# Altium schematic sheet ATmega_MCU.SchDoc
size B; Organization: Mechanart, LLC; Address1: 397 Laurie Meadows Drive; Address2: Apt. 437; Address3: San Mateo, CA 94403
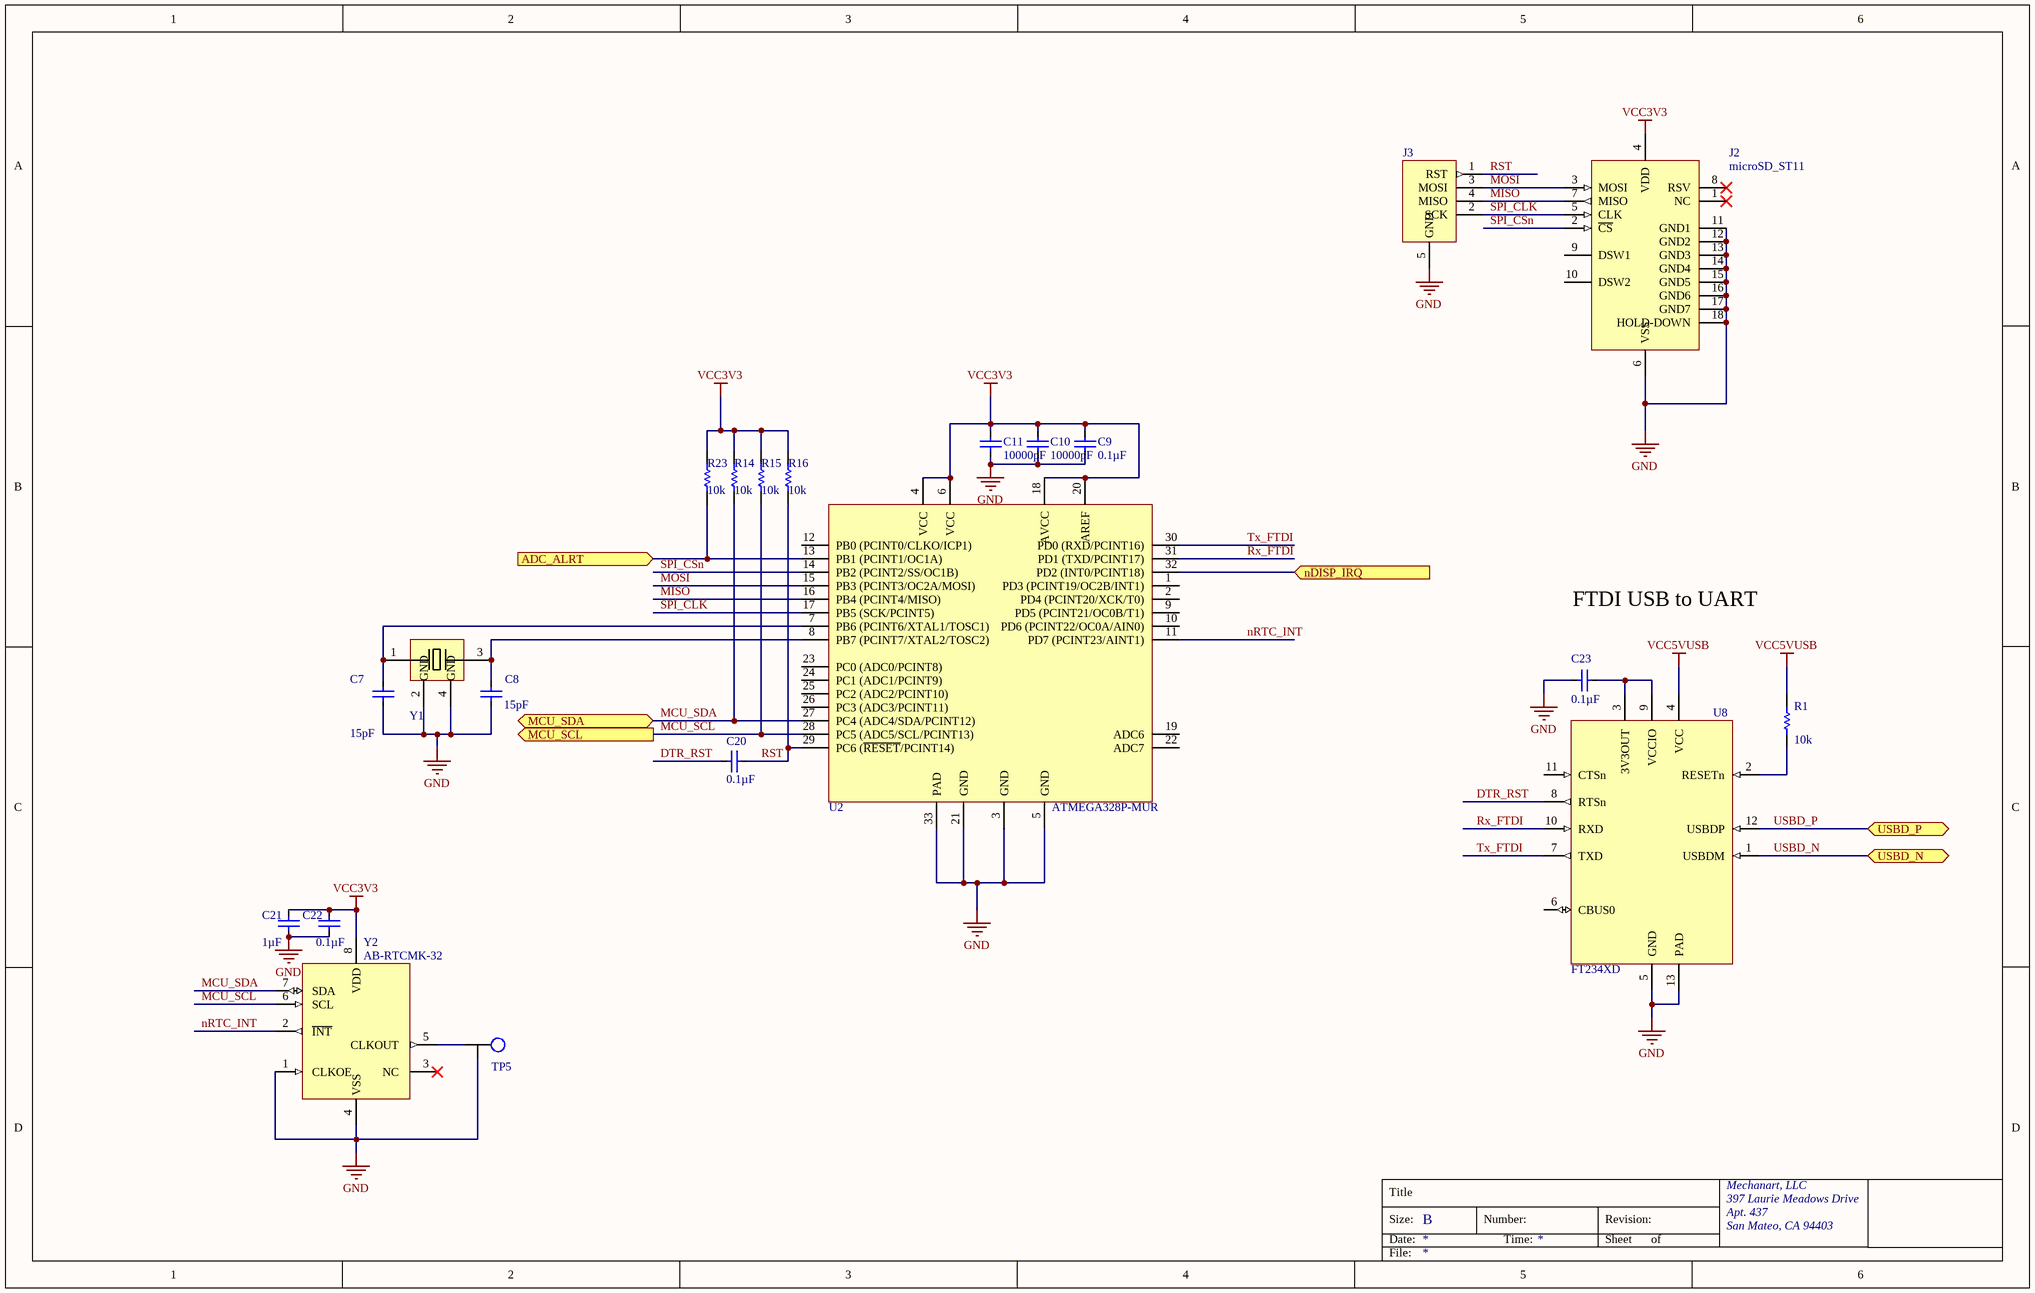
[diagram p0: ATmega_MCU.SchDoc]

## Parts
C7  15pF  [CAPC0603X33L15L]
C8  15pF  [CAPC0603X33L15L]
C9  0.1µF  [CAPC1005X50L25N]
C10  10000pF  [CAPC1005X50L25N]
C11  10000pF  [CAPC1005X50L25N]
C20  0.1µF  [CAPC1005X50L25N]
C21  1µF  [CAPC1005X50L25N]
C22  0.1µF  [CAPC1005X50L25N]
C23  0.1µF  [CAPC1005X50L25N]
J2  microSD_ST11  [microSD_ST11-H]
J3  POGO_SPI  [POGO_SPI]  (value not drawn)
R1  10k  [RESC1608X45L30N]
R14  10k  [RESC1005X40L25N]
R15  10k  [RESC1005X40L25N]
R16  10k  [RESC1005X40L25N]
R23  10k  [RESC1005X40L25N]
TP5  TPwGND  [TPwGND]  (value not drawn)
U2  Manufacturer Part Number: ATMEGA328P-MUR  [QFN50P500X500X100-33T325X325L]  (hidden comment: ATMEGA328P_32MLF)
U8  FT234XD  [SON13P45_300X300X80L40X23T250X160N]
Y1  ABM11  [XTALDFN200X160X59-4L]  (value not drawn)
Y2  AB-RTCMK-32  [SON100P320X250X100-8L]

## Ports
ADC_ALRT (in), MCU_SCL (out), MCU_SDA (bidir), nDISP_IRQ (in), USBD_N (bidir), USBD_P (bidir)

## Nets
GND: C7.2 C8.2 C9.2 C10.2 C11.2 C21.2 C22.2 C23.1 J2.6(VSS) J2.11(GND1) J2.12(GND2) J2.13(GND3) J2.14(GND4) J2.15(GND5) J2.16(GND6) J2.17(GND7) J2.18(HOLD-DOWN) J3.5(GND) TP5.2(GND) U2.3(GND) U2.5(GND) U2.21(GND) U2.33(PAD) U8.5(GND) U8.13(PAD) Y1.2(GND) Y1.4(GND) Y2.1(CLKOE) Y2.4(VSS)
VCC3V3: C9.1 C10.1 C11.1 C21.1 C22.1 J2.4(VDD) R14.2 R15.2 R16.2 R23.2 U2.4(VCC) U2.6(VCC) U2.18(AVCC) U2.20(AREF) Y2.8(VDD)
VCC5VUSB: R1.2 U8.4(VCC)
ADC_ALRT: R23.1 U2.13(PB1_(PCINT1/OC1A)) ; port ADC_ALRT
DTR_RST: C20.1 U8.8(RTSn)
MCU_SCL: R15.1 U2.28(PC5_(ADC5/SCL/PCINT13)) Y2.6(SCL) ; port MCU_SCL
MCU_SDA: R14.1 U2.27(PC4_(ADC4/SDA/PCINT12)) Y2.7(SDA) ; port MCU_SDA
MISO: J2.7(MISO) J3.4(MISO) U2.16(PB4_(PCINT4/MISO))
MOSI: J2.3(MOSI) J3.3(MOSI) U2.15(PB3_(PCINT3/OC2A/MOSI))
nDISP_IRQ: U2.32(PD2_(INT0/PCINT18)) ; port nDISP_IRQ
nRTC_INT: U2.11(PD7_(PCINT23/AINT1)) Y2.2(~{INT})
RST: C20.2 J3.1(RST) R16.1 U2.29(PC6_(~{RESET}/PCINT14))
Rx_FTDI: U2.31(PD1_(TXD/PCINT17)) U8.10(RXD)
SPI_CLK: J2.5(CLK) J3.2(SCK) U2.17(PB5_(SCK/PCINT5))
SPI_CSn: J2.2(~{CS}) U2.14(PB2_(PCINT2/SS/OC1B))
Tx_FTDI: U2.30(PD0_(RXD/PCINT16)) U8.7(TXD)
USBD_N: U8.1(USBDM) ; port USBD_N
USBD_P: U8.12(USBDP) ; port USBD_P
NetC7_1: C7.1 U2.7(PB6_(PCINT6/XTAL1/TOSC1)) Y1.1(OSC1)
NetC8_1: C8.1 U2.8(PB7_(PCINT7/XTAL2/TOSC2)) Y1.3(OSC2)
NetC23_2: C23.2 U8.3(3V3OUT) U8.9(VCCIO)
NetR1_1: R1.1 U8.2(RESETn)
NetTP5_1: TP5.1(TP) Y2.5(CLKOUT)

Not connected (* = marked no-connect by the designer): J2 1(NC)* 8(RSV)* 9(DSW1) 10(DSW2); U2 1(PD3_(PCINT19/OC2B/INT1)) 2(PD4_(PCINT20/XCK/T0)) 9(PD5_(PCINT21/OC0B/T1)) 10(PD6_(PCINT22/OC0A/AIN0)) 12(PB0_(PCINT0/CLKO/ICP1)) 19(ADC6) 22(ADC7) 23(PC0_(ADC0/PCINT8)) 24(PC1_(ADC1/PCINT9)) 25(PC2_(ADC2/PCINT10)) 26(PC3_(ADC3/PCINT11)); U8 6(CBUS0) 11(CTSn); Y2 3(NC)*

## Notes on the sheet
- FTDI USB to UART
- Title
- Size:
- Date:
- B
- Number:
- Time:
- Revision:
- Sheet
- of
- File:

## Library data of the parts
C7 C8 = GJM0335C1E150GB01D: CAP CER 15PF 25V NP0 0201; Manufacturer: Murata Electronics North America; Tolerance: ±2%; Temperature Coefficient: C0G, NP0; Design Item Id: GJM0335C1E150GB01D; Supplier 1: Digi-Key; Supplier Part Number 1: 490-10562-1-ND; Manufacturer Part Number: GJM0335C1E150GB01D; RoHS: RoHS Compliant; Category: Capacitors; Stock 1: 25849; Pricing 1: 1=0.19, 10=0.128, 50=0.0736, 100=0.0608, 250=0.0512, 500=0.04288, 1000=0.0352, 5000=0.02976 (USD); Packaging: Cut Tape (CT); Applications: RF, Microwave, High Frequency; Operating Temperature: -55°C ~ 125°C; Mounting Type: Surface Mount, MLCC; Package / Case: 0201 (0603 Metric); ComponentLink1URL: http://www.murata.com/~/media/webrenewal/support/library/catalog/products/capacitor/mlcc/c02e.ashx; ComponentLink1Description: http://www.murata.com/~/media/webrenewal/support/library/catalog/products/capacitor/mlcc/c02e.ashx; Capacitance: 15pF; Voltage - Rated: 25V; Ratings: -; Size / Dimension: 0.024" L x 0.012" W (0.60mm x 0.30mm); Height - Seated (Max): -; Thickness (Max): 0.013" (0.33mm); Lead Spacing: -; Features: High Q, Low Loss; Lead Style: -
C9 C20 C22 C23 = GRM155R71H104KE14D: CAP CER 0.1UF 50V X7R 0402; Manufacturer: Murata Electronics North America; Tolerance: ±10%; Design Item Id: GRM155R71H104KE14D; Supplier 1: Digi-Key; Supplier Part Number 1: 490-10700-1-ND; Manufacturer Part Number: GRM155R71H104KE14D; RoHS: RoHS Compliant; Category: Capacitors; Stock 1: 28600; Pricing 1: 1=0.1, 10=0.029, 50=0.0156, 100=0.0132, 250=0.0108, 500=0.00924, 1000=0.0072, 5000=0.006 (USD); Packaging: Cut Tape (CT); Applications: General Purpose; Operating Temperature: -55°C ~ 125°C; Mounting Type: Surface Mount, MLCC; Package / Case: 0402 (1005 Metric); ComponentLink1URL: http://www.murata.com/~/media/webrenewal/support/library/catalog/products/capacitor/mlcc/c02e.ashx; ComponentLink1Description: http://www.murata.com/~/media/webrenewal/support/library/catalog/products/capacitor/mlcc/c02e.ashx; Capacitance: 0.1µF; Voltage - Rated: 50V; Temperature Coefficient: X7R; Ratings: -; Size / Dimension: 0.039" L x 0.020" W (1.00mm x 0.50mm); Height - Seated (Max): -; Thickness (Max): 0.022" (0.55mm); Lead Spacing: -; Features: -; Lead Style: -
C10 C11 = GRM155R71H103KA88D: CAP CER 10000PF 50V X7R 0402; Manufacturer: Murata Electronics North America; Tolerance: ±10%; Design Item Id: GRM155R71H103KA88D; Supplier 1: Digi-Key; Supplier Part Number 1: 490-4516-1-ND; Manufacturer Part Number: GRM155R71H103KA88D; RoHS: RoHS Compliant; Category: Capacitors; Stock 1: 2228905; Pricing 1: 1=0.1, 10=0.012, 50=0.0066, 100=0.0055, 250=0.00452, 500=0.00386, 1000=0.003, 5000=0.0025 (USD); Packaging: Cut Tape (CT); Applications: General Purpose; Operating Temperature: -55°C ~ 125°C; Mounting Type: Surface Mount, MLCC; Package / Case: 0402 (1005 Metric); ComponentLink1URL: http://www.murata.com/~/media/webrenewal/support/library/catalog/products/capacitor/mlcc/c02e.ashx; ComponentLink1Description: http://www.murata.com/~/media/webrenewal/support/library/catalog/products/capacitor/mlcc/c02e.ashx; Capacitance: 10000pF; Voltage - Rated: 50V; Temperature Coefficient: X7R; Ratings: -; Size / Dimension: 0.039" L x 0.020" W (1.00mm x 0.50mm); Height - Seated (Max): -; Thickness (Max): 0.022" (0.55mm); Lead Spacing: -; Features: -; Lead Style: -
C21 = GRM155R70J105KA12D: CAP CER 1UF 6.3V X7R 0402; Manufacturer: Murata Electronics North America; Tolerance: ±10%; Design Item Id: GRM155R70J105KA12D; Supplier 1: Digi-Key; Supplier Part Number 1: 490-10024-1-ND; Manufacturer Part Number: GRM155R70J105KA12D; RoHS: RoHS Compliant; Category: Capacitors; Stock 1: 26230; Pricing 1: 1=0.1, 10=0.076, 50=0.041, 100=0.0347, 250=0.02836, 500=0.02426, 1000=0.0189, 5000=0.01575 (USD); Packaging: Cut Tape (CT); Applications: General Purpose; Operating Temperature: -55°C ~ 125°C; Mounting Type: Surface Mount, MLCC; Package / Case: 0402 (1005 Metric); ComponentLink1URL: http://www.murata.com/~/media/webrenewal/support/library/catalog/products/capacitor/mlcc/c02e.ashx; ComponentLink1Description: http://www.murata.com/~/media/webrenewal/support/library/catalog/products/capacitor/mlcc/c02e.ashx; Capacitance: 1µF; Voltage - Rated: 6.3V; Temperature Coefficient: X7R; Ratings: -; Size / Dimension: 0.039" L x 0.020" W (1.00mm x 0.50mm); Height - Seated (Max): -; Thickness (Max): 0.022" (0.55mm); Lead Spacing: -; Features: Derating Recommended; Lead Style: -
J2 = ST11S008V4HR2000: CONN MICRO SD CARD PUSH-PUSH R/A; Manufacturer: JAE Electronics; Design Item Id: ST11S008V4HR2000; Supplier 1: Digi-Key; Supplier Part Number 1: 670-2695-1-ND; Manufacturer Part Number: ST11S008V4HR2000; RoHS: RoHS Compliant; Category: Connectors, Interconnects; Stock 1: 1343; Pricing 1: 1=2.66, 10=2.415, 25=2.2668, 50=2.1684, 100=2.0698, 250=1.87264, 500=1.7248, 1000=1.4784 (USD); Packaging: Cut Tape (CT)
J3 = POGO_SPI: 5-pin SPI ISP pogo land with RST + GND; Design Item Id: POGO_SPI
R1 = ERJ-3GEYJ103V: RES 10K OHM 1/10W 5% 0603 SMD; Manufacturer: Panasonic Electronic Components; Power (Watts): 0.1W, 1/10W; Temperature Coefficient: ±200ppm/°C; Resistance: 10k; Design Item Id: ERJ-3GEYJ103V; Footprint: RESC_1608[0603]_N; Supplier 1: Digi-Key; Supplier Part Number 1: P10KGCT-ND; Manufacturer Part Number: ERJ-3GEYJ103V; RoHS: RoHS Compliant; Category: Resistors; Stock 1: 3519552; Pricing 1: 1=0.1, 50=0.0126, 100=0.0096, 250=0.00716, 500=0.00528, 1000=0.00352, 2500=0.00297 (USD); Packaging: Cut Tape (CT); Operating Temperature: -55°C ~ 155°C; Package / Case: 0603 (1608 Metric); Supplier Device Package: 0603; ComponentLink1URL: http://industrial.panasonic.com/www-cgi/jvcr13pz.cgi?E+PZ+3+AOA0001+ERJ3GEYJ103V+7+WW; ComponentLink1Description: http://industrial.panasonic.com/www-cgi/jvcr13pz.cgi?E+PZ+3+AOA0001+ERJ3GEYJ103V+7+WW; Tolerance: ±5%; Composition: Thick Film; Features: Automotive AEC-Q200 Qualified; Size / Dimension: 0.063" L x 0.031" W (1.60mm x 0.80mm); Height: 0.022" (0.55mm); Number of Terminations: 2
R14-R16 R23 = CRCW040210K0JNED: RES SMD 10K OHM 5% 1/16W 0402; Manufacturer: Vishay Dale; Power (Watts): 0.063W, 1/16W; Temperature Coefficient: ±200ppm/°C; Design Item Id: CRCW040210K0JNED; Resistance: 10k; Footprint: RESC_1005[0402]_N; Supplier 1: Digi-Key; Supplier Part Number 1: 541-10KJCT-ND; Manufacturer Part Number: CRCW040210K0JNED; RoHS: RoHS Compliant; Category: Resistors; Stock 1: 446077; Pricing 1: 10=0.074, 50=0.04, 200=0.02295, 1000=0.01566 (USD); Packaging: Cut Tape (CT); Operating Temperature: -55°C ~ 155°C; Package / Case: 0402 (1005 Metric); Supplier Device Package: 0402 (1005 Metric); ComponentLink1URL: http://www.vishay.com/docs/20035/dcrcwe3.pdf; ComponentLink1Description: http://www.vishay.com/docs/20035/dcrcwe3.pdf; Tolerance: ±5%; Composition: Thick Film; Features: Automotive AEC-Q200; Size / Dimension: 0.039" L x 0.020" W (1.00mm x 0.50mm); Height: 0.016" (0.40mm); Number of Terminations: 2
U2 = ATMEGA328P-MUR: IC MCU 8BIT 32KB FLASH 32QFN; Manufacturer: Atmel; Core Processor: AVR; Core Size: 8-Bit; Speed: 20MHz; Connectivity: I²C, SPI, UART/USART; Peripherals: Brown-out Detect/Reset, POR, PWM, WDT; Number of I/O: 23; Program Memory Size: 32KB (16K x 16); EEPROM Size: 1K x 8; RAM Size: 2K x 8; Voltage - Supply (Vcc/Vdd): 1.8 V ~ 5.5 V; Data Converters: A/D 8x10b; Oscillator Type: Internal; Design Item Id: ATMEGA328P-MUR; Supplier 1: Digi-Key; Supplier Part Number 1: ATMEGA328P-MURCT-ND; RoHS: RoHS Compliant; Category: Integrated Circuits (ICs); Stock 1: 17278; Pricing 1: 1=3.7, 10=3.305, 25=2.9748, 100=2.7103, 250=2.44588, 500=2.19468, 1000=1.85094 (USD); Packaging: Cut Tape (CT); Operating Temperature: -40°C ~ 85°C; Package / Case: 32-VFQFN Exposed Pad; Supplier Device Package: 32-VQFN (5x5); ComponentLink1URL: http://www.atmel.com/images/atmel-8271-8-bit-avr-microcontroller-atmega48a-48pa-88a-88pa-168a-168pa-328-328p_datasheet_summary.pdf; ComponentLink1Description: http://www.atmel.com/images/atmel-8271-8-bit-avr-microcontroller-atmega48a-48pa-88a-88pa-168a-168pa-328-328p_datasheet_summary.pdf; Program Memory Type: FLASH
U8 = FT234XD-R: IC USB SERIAL BASIC UART 12DFN; Manufacturer: FTDI, Future Technology Devices International Ltd; Voltage - Supply: 2.97 V ~ 5.5 V; Function: Bridge, USB to UART; Standards: USB 2.0; Current - Supply: 8mA; Design Item Id: FT234XD-R; Supplier 1: Digi-Key; Supplier Part Number 1: 768-1178-1-ND; Manufacturer Part Number: FT234XD-R; RoHS: RoHS Compliant; Category: Integrated Circuits (ICs); Stock 1: 20803; Pricing 1: 1=2.3, 25=1.97, 100=1.9, 250=1.71, 500=1.5525, 1000=1.5295 (USD); Packaging: Cut Tape (CT); Operating Temperature: -40°C ~ 85°C; Package / Case: 12-VFDFN Exposed Pad; Supplier Device Package: 12-DFN (3x3); ComponentLink1URL: http://www.ftdichip.com/Support/Documents/DataSheets/ICs/DS_FT234XD.pdf; ComponentLink1Description: http://www.ftdichip.com/Support/Documents/DataSheets/ICs/DS_FT234XD.pdf; Protocol: USB; Part Status: Active; Interface: UART
Y1 = ABM11-16.000MHZ-B7G-T: CRYSTAL 16.0000MHZ 10PF SMD; Manufacturer: Abracon LLC; Frequency: 16MHz; Frequency Stability: ±15ppm; ESR (Equivalent Series Resistance): 150 Ohm; Operating Mode: Fundamental; Ratings: COTS; Design Item Id: ABM11-16.000MHZ-B7G-T; Supplier 1: Digi-Key; Supplier Part Number 1: 535-12628-1-ND; Manufacturer Part Number: ABM11-16.000MHZ-B7G-T; RoHS: RoHS Compliant; Category: Crystals and Oscillators; Stock 1: 2675; Pricing 1: 1=1.09, 10=0.968, 50=0.904, 100=0.8, 500=0.756 (USD); Packaging: Cut Tape (CT); Type: MHz Crystal; Operating Temperature: -20°C ~ 70°C; Mounting Type: Surface Mount; Package / Case: 4-SMD, No Lead (DFN, LCC); ComponentLink1URL: http://www.abracon.com/Resonators/ABM11.pdf; ComponentLink1Description: http://www.abracon.com/Resonators/ABM11.pdf; Frequency Tolerance: ±15ppm; Load Capacitance: 10pF; Size / Dimension: 0.079" L x 0.063" W (2.00mm x 1.60mm); Height: 0.023" (0.59mm)
Y2 = AB-RTCMK-32.768KHZ-T3: IC RTC CLK/CALENDAR I2C 8-SMT; Manufacturer: Abracon LLC; Voltage - Supply: 1.3 V ~ 5.5 V; Time Format: HH:MM:SS (12/24 hr); Date Format: YY-MM-DD; Interface: I²C, 2-Wire Serial; Current - Timekeeping (Max): 2µA @ 3V; Design Item Id: AB-RTCMK-32.768KHZ-T3; Supplier 1: Digi-Key; Supplier Part Number 1: 535-11916-1-ND; Manufacturer Part Number: AB-RTCMK-32.768KHZ-T3; RoHS: RoHS Compliant; Category: Integrated Circuits (ICs); Stock 1: 797; Pricing 1: 1=5.33, 10=4.773, 25=4.292, 100=3.9035, 250=3.53352, 500=3.1635, 750=2.86751, 1000=2.664 (USD); Packaging: Cut Tape (CT); Type: Clock/Calendar; Operating Temperature: -40°C ~ 85°C; Mounting Type: Surface Mount; Package / Case: 8-SMD Module; Supplier Device Package: 8-SMT; ComponentLink1URL: http://www.abracon.com/Precisiontiming/AB-RTCMK-32768kHz.pdf; ComponentLink1Description: http://www.abracon.com/Precisiontiming/AB-RTCMK-32768kHz.pdf; Features: Alarm, Leap Year, Square Wave Output, TCXO/Crystal; Memory Size: -; Voltage - Supply, Battery: -
TP5 = TPwGND: Design Item Id: TPwGND